# Altium schematic sheet Top.SchDoc
size 431 x 279 mm; ENG_APP_DATE: --/--/--; DSN_APP_DATE: --/--/--; CHK_APP_DATE: --/--/--
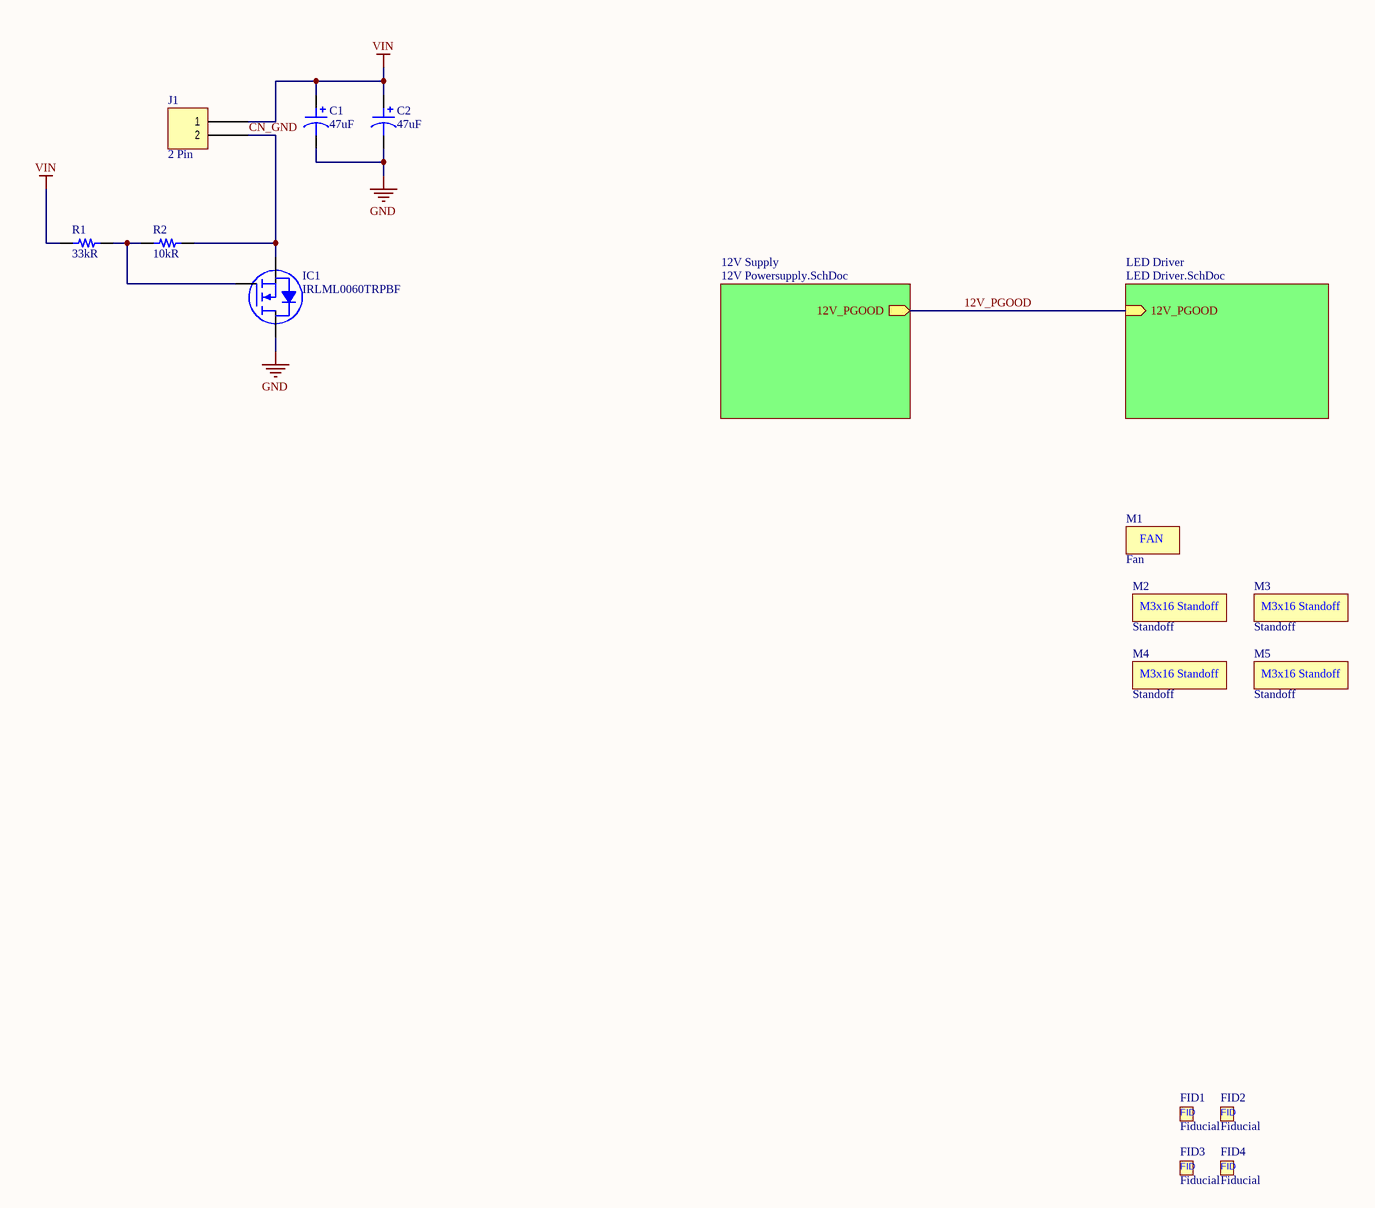
[diagram p0: Top.SchDoc]

## Parts
C1  47uF  [CAP ALUM 8.3MM]
C2  47uF  [CAP ALUM 8.3MM]
FID1  Fiducial  [Fiducial]  (no BOM)
FID2  Fiducial  [Fiducial]  (no BOM)
FID3  Fiducial  [Fiducial]  (no BOM)
FID4  Fiducial  [Fiducial]  (no BOM)
IC1  IRLML0060TRPBF  [INFINEON SOT-23-3]
J1  2 Pin  [FCI 06-381-2PIN]
M1  Fan  [40MM Fan]
M2  Standoff  [M3x12.7 M-F Standoff]
M3  Standoff  [M3x12.7 M-F Standoff]
M4  Standoff  [M3x12.7 M-F Standoff]
M5  Standoff  [M3x12.7 M-F Standoff]
R1  33kR  [RES 0402/1005]
R2  10kR  [RES 0402/1005]

## Sub-sheets
12V Supply = 12V Powersupply.SchDoc: 12V_PGOOD (out)
LED Driver = LED Driver.SchDoc: 12V_PGOOD (in)

## Nets
GND: C1.2 C2.2 IC1.3(D)
VIN: C1.1 C2.1 J1.1 R1.2
12V_PGOOD: sheet 12V Supply/12V_PGOOD, sheet LED Driver/12V_PGOOD
CN_GND: IC1.2(S) J1.2 R2.2
NetIC1_1: IC1.1(G) R1.1 R2.1

## Notes on the sheet
- 8
- 7
- 6
- 5
- 4
- 3
- DWG. NO.
- REV.
- SHT.
- 2
- 1
- THIS DOCUMENT AND THE DATA DISCLOSED HEREIN OR HEREWITH IS THE PROPERTY OF ALTIUM LIMITED AND MAY BE FREELY DISTRIBUTED IN WHOLE. NO RIGHTS ARE RESERVED OR EXPRESS OR IMPLIED WARANTEE GIVEN.
- REVISION
- DESCRIPTION
- DATE
- APPROVED
- F
- E
- D
- C
- B
- ENG:
- APPROVALS
- PROJECT
- SUITE 200
- 2175 SALK AVENUE
- CARLSBAD, CA 92008
- A
- DSN:
- CHK:
- REFERENCE DOCUMENTS
- PROJECT REVISION:
- TITLE
- DOCUMENT REVISION:
- DESIGN ITEM:
- USA
- BOM:
- FAB DWG:
- PCB DWG:
- ASSY DWG:
- SCALE:
- SIZE
- CAGE CODE
- FILE NAME
- DWG NO.
- SHEET
- OF
- REV
- (in symbol Fan) FAN
- (in symbol Fiducial) FID
- (in symbol Standoff) M3x16 Standoff

## Library data of the parts
C1 C2 = Polarised Capacitor: Aluminum Electrolytic Capacitors - SMD 63volts 47uF 20% 85C 8X10; Manufacturer 1: Nichicon; Manufacturer Part Number 1: UUR1J470MNL1GS; Dielectric Material: Aluminium; Ripple Current: 140mA; Voltage Rating: 63V; Life (Hours): 2000Hour; Dissipation Factor: 0.12%; Supplier 1: Digi-Key; Supplier Part Number 1: 493-6235-1-ND; RoHS: Yes; Category: Aluminum Electrolytic Capacitors; Stock 1: 3231; Pricing 1: 1=0.55000, 10=0.38800, 100=0.25520 (USD); Mount: Surface Mount; Case/Package: Radial; Contact Plating: Tin; Min Operating Temperature: -40°C; Max Operating Temperature: 85°C; Capacitance: 47uF; Tolerance: 20%; Packaging: Tape and Reel; Package Quantity: 500; Voltage Rating (DC): 63V; Termination: SMD/SMT; Features: General Purpose; Diameter: 8mm; Length: 10mm; Height: 10mm; Height - Seated (Max): 0.413inch; Radiation Hardening: No; Lead Free: Lead Free; ComponentLink1URL: https://datasheet.ciiva.com/6326/e-ur-6326870.pdf?src-supplier=Digi-Key; ComponentLink1Description: https://datasheet.ciiva.com/6326/e-ur-6326870.pdf?src-supplier=Digi-Key; ComponentLink2URL: https://datasheet.ciiva.com/6326/e-ur-6326872.pdf?src-supplier=Digi-Key; ComponentLink2Description: https://datasheet.ciiva.com/6326/e-ur-6326872.pdf?src-supplier=Digi-Key; ComponentLink3URL: https://datasheet.ciiva.com/11686/e-ur-11686922.pdf?src-supplier=Avnet; ComponentLink3Description: https://datasheet.ciiva.com/11686/e-ur-11686922.pdf?src-supplier=Avnet; ComponentLink4URL: https://datasheet.ciiva.com/16380/e-ur-16380363.pdf?src-supplier=Future+Electronics; ComponentLink4Description: https://datasheet.ciiva.com/16380/e-ur-16380363.pdf?src-supplier=Future+Electronics
IC1 = INFINEON MOSFET N-CH SOT-23-3 GSD: MOSFET MOSFT 60V 2.7A 92mOhm 2.5nC Qg; Manufacturer 1: International Rectifier; Rise Time: 6.3ns; Gate to Source Voltage (Vgs): 16V; Turn-Off Delay Time: 6.8ns; Fall Time: 4.2ns; Input Capacitance: 290pF; Max Power Dissipation: 1.25W; Rds On Max: 92mR; Turn-On Delay Time: 5.4ns; Drain to Source Resistance: 116mR; Recovery Time: 21ns; Nominal Vgs: 2.5V; Number of Elements: 1; Element Configuration: Single; Supplier 1: Digi-Key; Supplier Part Number 1: IRLML0060TRPBFCT-ND; Manufacturer Part Number 1: IRLML0060TRPBF; RoHS: Yes; Category: MOSFETs; Stock 1: 361915; Pricing 1: 1=0.40000, 10=0.34300, 100=0.23780, 500=0.18566, 1000=0.15091 (USD); Mount: Surface Mount; Case/Package: SOT-23; Number of Pins: 3; Min Operating Temperature: -55°C; Max Operating Temperature: 150°C; Continuous Drain Current (ID): 2.7A; Package Quantity: 1; Packaging: Tape and Reel; Drain to Source Voltage (Vdss): 60V; Drain to Source Breakdown Voltage: 60V; Power Dissipation: 1.25W; Threshold Voltage: 2.5V; On-State Resistance: 92MR; Length: 3.04mm; Height: 1.02mm; Width: 1.4mm; REACH SVHC: No SVHC; Lead Free: Lead Free; ComponentLink1URL: https://datasheet.ciiva.com/6383/irlml0060pbf-6383265.pdf?src-supplier=Digi-Key; ComponentLink1Description: https://datasheet.ciiva.com/6383/irlml0060pbf-6383265.pdf?src-supplier=Digi-Key; ComponentLink2URL: https://datasheet.ciiva.com/7935/irlml0060pbf-7935677.pdf?src-supplier=Element14; ComponentLink2Description: https://datasheet.ciiva.com/7935/irlml0060pbf-7935677.pdf?src-supplier=Element14; ComponentLink3URL: https://datasheet.ciiva.com/6383/irlml0060pbf-6383262.pdf?src-supplier=Digi-Key; ComponentLink3Description: https://datasheet.ciiva.com/6383/irlml0060pbf-6383262.pdf?src-supplier=Digi-Key; ComponentLink4URL: https://datasheet.ciiva.com/16393/irlml0060pbf-16393454.pdf?src-supplier=Future+Electronics; ComponentLink4Description: https://datasheet.ciiva.com/16393/irlml0060pbf-16393454.pdf?src-supplier=Future+Electronics; ComponentLink5URL: https://datasheet.ciiva.com/29325/161182-da-01-en-mosfet-irlml0060trpbf-sot23-ir-29325526.pdf?src-supplier=Conrad; ComponentLink5Description: https://datasheet.ciiva.com/29325/161182-da-01-en-mosfet-irlml0060trpbf-sot23-ir-29325526.pdf?src-supplier=Conrad
J1 = 2 Pin: TERM BLOCK HDR 2POS 90DEG 3.81MM; Manufacturer 1: Amphenol; Manufacturer Part Number 1: OQ0232510000G; Supplier 1: Digi-Key; Supplier Part Number 1: 609-3819-ND; RoHS: No; Stock 1: 14524; Pricing 1: 1=0.49000, 10=0.25600, 25=0.18120, 50=0.15420, 100=0.14870, 250=0.12572, 500=0.11628, 1000=0.10275, 5000=0.07842 (USD); ComponentLink1URL: http://www.anytek.com.tw/UserUpFiles/20120526/jMKyryrC5T7A.pdf?src-supplier=Digi-Key; ComponentLink1Description: http://www.anytek.com.tw/UserUpFiles/20120526/jMKyryrC5T7A.pdf?src-supplier=Digi-Key
M1 = Fan: FAN AXIAL 40X40X15MM 12V WIRE; Manufacturer 1: Delta Design; Manufacturer Part Number 1: AFB0412HHB-F00; Power Rating: 1.56W; Airflow: 11.5CFM; Noise: 32dBA; Bearing Type: Ball; Noise Level: 32dB; Current Rating: 130mA; RPM: 8300RPM; Approvals: UL,CSA,VDE,CE; Supplier 1: Digi-Key; Supplier Part Number 1: 603-1996-ND; RoHS: Yes; Category: Uncategorized; Stock 1: 576; Pricing 1: 1=13.69000, 10=12.79300, 25=11.60240, 50=10.71000, 100=9.37130, 250=8.77624, 500=8.18126 (USD); Case/Package: Axial; Weight: 0.055lb; Housing Material: Plastic; Min Operating Temperature: 14°C; Max Operating Temperature: 158°C; Voltage Rating: 12V; Termination: 3 Wire Leads; Package Quantity: 448; Max Power Dissipation: 1.56W; Length: 40mm; Width: 15mm; Depth: 40mm; ComponentLink1URL: http://components.arrow.com/part/dataview/51230374S8860450N1419?src-supplier=Arrow; ComponentLink1Description: http://components.arrow.com/part/dataview/51230374S8860450N1419?src-supplier=Arrow; ComponentLink2URL: http://www.delta-fan.com/Download/Spec/AFB0412HHB-F00.pdf?src-supplier=Digi-Key; ComponentLink2Description: http://www.delta-fan.com/Download/Spec/AFB0412HHB-F00.pdf?src-supplier=Digi-Key
M2-M5 = Standoff: HEX STANDOFF M3 NYLON 1/2; Manufacturer 1: Essentra Components; Manufacturer Part Number 1: NTS-12; Gender: Male, Female; Threaded/Unthreaded: Threaded; Outside Diameter: 0.236inch; Supplier 1: Digi-Key; Supplier Part Number 1: RPC4557-ND; RoHS: Yes; Category: Spacers, Standoffs; Stock 1: 8273; Pricing 1: 1=0.60000, 10=0.55600, 25=0.51320, 100=0.42770, 500=0.34212, 1000=0.30791, 5000=0.24804, 10000=0.21383, 25000=0.17106 (USD); Color: Natural; Material: Nylon; Package Quantity: 1000; Length: 0.75inch; Thread Size: M3; Lead Free: Lead Free; ComponentLink1URL: http://www.essentracomponents.com.sg/images-line/pdfs/NTS.pdf?src-supplier=Digi-Key; ComponentLink1Description: http://www.essentracomponents.com.sg/images-line/pdfs/NTS.pdf?src-supplier=Digi-Key
R1 = Resistor: RES SMD 33K OHM 5% 1/16W 0402; Manufacturer 1: Yageo; Manufacturer Part Number 1: RC0402JR-0733KL; Power Rating: 63mW; Voltage Rating: 50V; Temperature Coefficient: 100ppm/°C; Supplier 1: Digi-Key; Supplier Part Number 1: 311-33KJRCT-ND; RoHS: Yes; Category: Chip SMD Resistors; Stock 1: 1421022; Pricing 1: 1=0.10000, 10=0.01300, 100=0.00530, 1000=0.00236, 2500=0.00205, 5000=0.00169 (USD); Case/Package: 0402; Case Code (Imperial): 0402; Case Code (Metric): 1005; Min Operating Temperature: -55°C; Max Operating Temperature: 155°C; Resistance: 33kR; Tolerance: 5%; Packaging: Tape and Reel; Termination: SMD/SMT; Composition: Thick Film; Military Standard: Not; Working Voltage: 50V; Number of Terminations: 2; Length: 1mm; Depth: 0.5mm; REACH SVHC: No SVHC; Lead Free: Lead Free; ComponentLink1URL: https://datasheet.ciiva.com/7850/1018594-7850198.pdf?src-supplier=Element14; ComponentLink1Description: https://datasheet.ciiva.com/7850/1018594-7850198.pdf?src-supplier=Element14; ComponentLink2URL: https://datasheet.ciiva.com/7850/1018594-7850199.pdf?src-supplier=Element14; ComponentLink2Description: https://datasheet.ciiva.com/7850/1018594-7850199.pdf?src-supplier=Element14; ComponentLink3URL: https://datasheet.ciiva.com/16740/pyu-rc0402-51-rohs-l-6-r-16740743.pdf?src-supplier=Future+Electronics; ComponentLink3Description: https://datasheet.ciiva.com/16740/pyu-rc0402-51-rohs-l-6-r-16740743.pdf?src-supplier=Future+Electronics; ComponentLink4URL: https://datasheet.ciiva.com/5558/pyu-rc0402-51-rohs-l-6-r-5558154.pdf?src-supplier=Mouser; ComponentLink4Description: https://datasheet.ciiva.com/5558/pyu-rc0402-51-rohs-l-6-r-5558154.pdf?src-supplier=Mouser; ComponentLink5URL: https://datasheet.ciiva.com/7983/1018594-7983578.pdf?src-supplier=Element14; ComponentLink5Description: https://datasheet.ciiva.com/7983/1018594-7983578.pdf?src-supplier=Element14
R2 = Resistor: RES SMD 10K OHM 5% 1/16W 0402; Manufacturer 1: Yageo; Manufacturer Part Number 1: RC0402JR-0710KL; Temperature Coefficient: 100ppm/°C; Power Rating: 62.5mW; Voltage Rating: 50V; Max Power Dissipation: 63mW; Supplier 1: Digi-Key; Supplier Part Number 1: 311-10KJRCT-ND; RoHS: Yes; Category: Chip SMD Resistors; Stock 1: 29833785; Pricing 1: 1=0.10000, 10=0.01300, 100=0.00530, 1000=0.00236, 2500=0.00205, 5000=0.00169 (USD); Case/Package: 0402; Case Code (Metric): 1005; Case Code (Imperial): 0402; Min Operating Temperature: -55°C; Max Operating Temperature: 155°C; Resistance: 10kR; Tolerance: 5%; Packaging: Tape and Reel; Package Quantity: 1; Composition: Thick Film; Number of Terminations: 2; Termination: SMD/SMT; Military Standard: Not; Features: Moisture Resistant; Length: 1mm; Height: 0.016inch; Width: 0.02inch; Depth: 0.5mm; REACH SVHC: Unknown; Lead Free: Lead Free; ComponentLink1URL: https://datasheet.ciiva.com/2452/pyu-r-int-thick-7-2452626.pdf?src-supplier=Digi-Key; ComponentLink1Description: https://datasheet.ciiva.com/2452/pyu-r-int-thick-7-2452626.pdf?src-supplier=Digi-Key; ComponentLink2URL: https://datasheet.ciiva.com/7850/1018594-7850136.pdf?src-supplier=Element14; ComponentLink2Description: https://datasheet.ciiva.com/7850/1018594-7850136.pdf?src-supplier=Element14; ComponentLink3URL: https://datasheet.ciiva.com/2452/pyu-r-int-thick-7-2452627.pdf?src-supplier=Digi-Key; ComponentLink3Description: https://datasheet.ciiva.com/2452/pyu-r-int-thick-7-2452627.pdf?src-supplier=Digi-Key; ComponentLink4URL: https://datasheet.ciiva.com/2452/pyu-r-int-thick-7-2452628.pdf?src-supplier=Digi-Key; ComponentLink4Description: https://datasheet.ciiva.com/2452/pyu-r-int-thick-7-2452628.pdf?src-supplier=Digi-Key; ComponentLink5URL: https://datasheet.ciiva.com/7850/1018594-7850137.pdf?src-supplier=Element14; ComponentLink5Description: https://datasheet.ciiva.com/7850/1018594-7850137.pdf?src-supplier=Element14; ComponentLink6URL: https://datasheet.ciiva.com/12669/pyu-rc0402-51-rohs-l-6-r-12669687.pdf?src-supplier=Mouser; ComponentLink6Description: https://datasheet.ciiva.com/12669/pyu-rc0402-51-rohs-l-6-r-12669687.pdf?src-supplier=Mouser